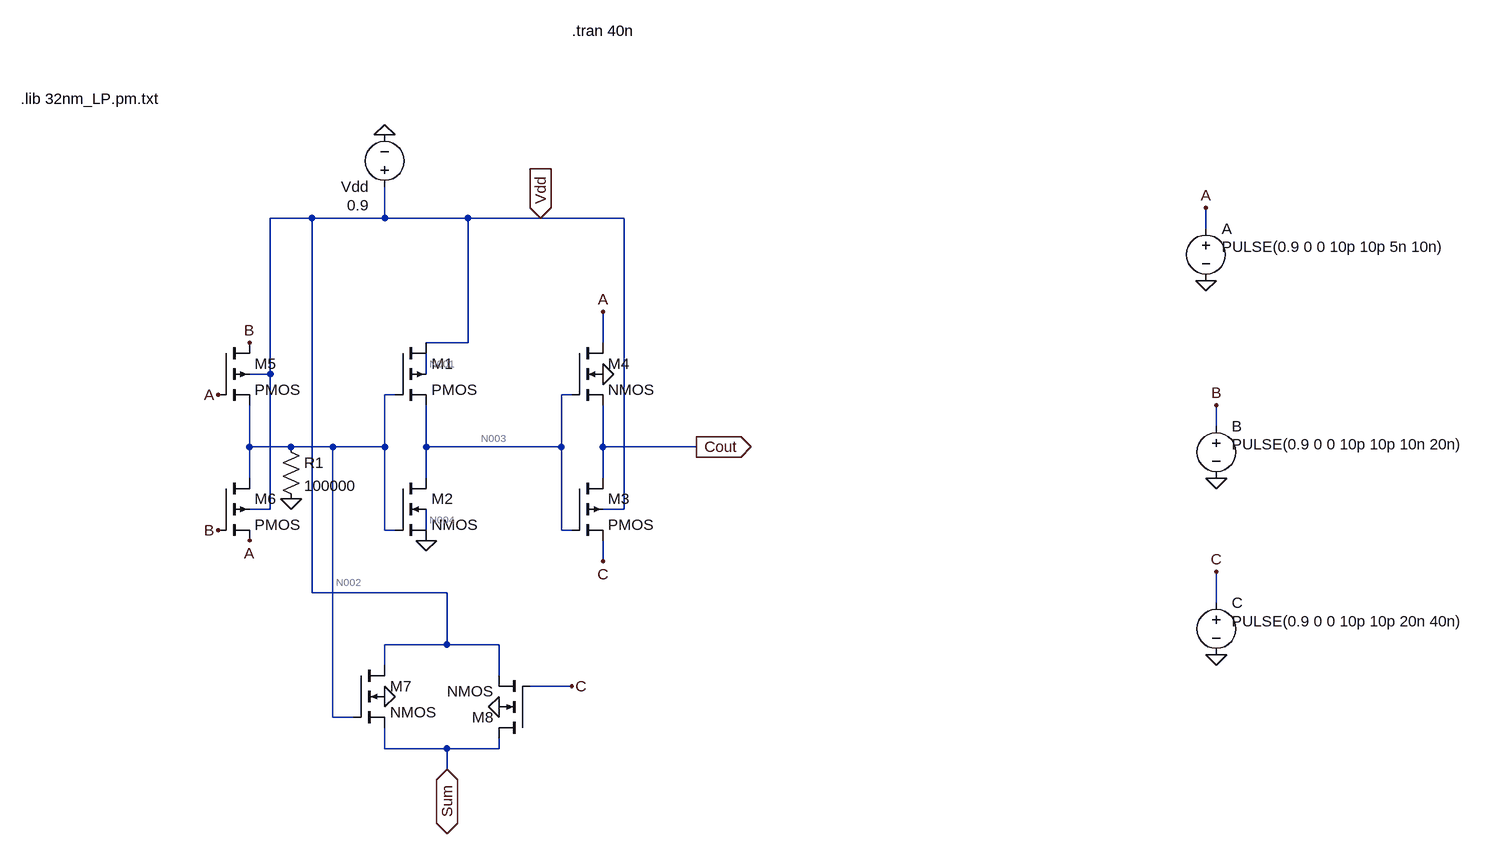
[diagram p0: schematic InXA2_32nm.asc]
InXA2_32nm.asc, the LTspice schematic file:
Version 4
SHEET 1 1044 720
WIRE -752 -240 -816 -240
WIRE -640 -240 -640 -288
WIRE -640 -240 -752 -240
WIRE -512 -240 -640 -240
WIRE -400 -240 -512 -240
WIRE -272 -240 -400 -240
WIRE 624 -224 624 -256
WIRE -512 -48 -512 -240
WIRE -512 -48 -576 -48
WIRE -304 -48 -304 -96
WIRE -816 0 -816 -240
WIRE -816 0 -848 0
WIRE -576 0 -576 -32
WIRE -624 32 -640 32
WIRE -352 32 -368 32
WIRE 640 80 640 48
WIRE -848 112 -848 48
WIRE -784 112 -848 112
WIRE -720 112 -784 112
WIRE -640 112 -640 32
WIRE -640 112 -720 112
WIRE -576 112 -576 48
WIRE -368 112 -368 32
WIRE -368 112 -576 112
WIRE -304 112 -304 48
WIRE -160 112 -304 112
WIRE -848 160 -848 112
WIRE -576 160 -576 112
WIRE -304 160 -304 112
WIRE -816 208 -816 0
WIRE -816 208 -848 208
WIRE -272 208 -272 -240
WIRE -272 208 -304 208
WIRE -640 240 -640 112
WIRE -624 240 -640 240
WIRE -576 240 -576 208
WIRE -368 240 -368 112
WIRE -352 240 -368 240
WIRE -304 288 -304 256
WIRE -752 336 -752 -240
WIRE -544 336 -752 336
WIRE 640 352 640 304
WIRE -544 416 -544 336
WIRE -544 416 -640 416
WIRE -464 416 -544 416
WIRE -640 448 -640 416
WIRE -464 464 -464 416
WIRE -352 480 -416 480
WIRE -720 528 -720 112
WIRE -688 528 -720 528
WIRE -640 576 -640 544
WIRE -544 576 -640 576
WIRE -464 576 -464 560
WIRE -464 576 -544 576
WIRE -544 608 -544 576
FLAG 624 -144 0
FLAG 640 160 0
FLAG 640 432 0
FLAG 624 -256 A
FLAG 640 48 B
FLAG 640 304 C
FLAG -400 -240 Vdd
IOPIN -400 -240 In
FLAG -640 -368 0
FLAG -896 32 A
FLAG -848 256 A
FLAG -896 240 B
FLAG -848 -48 B
FLAG -576 256 0
FLAG -304 0 0
FLAG -304 -96 A
FLAG -304 288 C
FLAG -160 112 Cout
IOPIN -160 112 Out
FLAG -544 608 Sum
IOPIN -544 608 BiDir
FLAG -352 480 C
FLAG -640 496 0
FLAG -464 512 0
FLAG -784 192 0
SYMBOL voltage 624 -240 R0
WINDOW 3 24 44 Left 2
WINDOW 123 0 0 Left 0
WINDOW 39 0 0 Left 0
SYMATTR Value PULSE(0.9 0 0 10p 10p 5n 10n)
SYMATTR InstName A
SYMBOL voltage 640 64 R0
WINDOW 3 24 44 Left 2
WINDOW 123 0 0 Left 0
WINDOW 39 0 0 Left 0
SYMATTR Value PULSE(0.9 0 0 10p 10p 10n 20n)
SYMATTR InstName B
SYMBOL voltage 640 336 R0
WINDOW 3 24 44 Left 2
WINDOW 123 0 0 Left 0
WINDOW 39 0 0 Left 0
SYMATTR Value PULSE(0.9 0 0 10p 10p 20n 40n)
SYMATTR InstName C
SYMBOL voltage -640 -272 R180
WINDOW 3 24 -12 Left 2
WINDOW 123 0 0 Left 0
WINDOW 39 0 0 Left 0
SYMATTR Value 0.9
SYMATTR InstName Vdd
SYMBOL pmos4 -624 -48 R0
SYMATTR InstName M1
SYMATTR Value2 l=32n w=128n
SYMBOL nmos4 -624 160 R0
SYMATTR InstName M2
SYMATTR Value2 l=32n w=64n
SYMBOL nmos4 -352 -48 R0
SYMATTR InstName M4
SYMATTR Value2 l=32n w=64n
SYMBOL pmos4 -352 160 R0
SYMATTR InstName M3
SYMATTR Value2 l=32n w=128n
SYMBOL pmos4 -896 -48 R0
SYMATTR InstName M5
SYMATTR Value2 l=32n w=128n
SYMBOL pmos4 -896 160 R0
SYMATTR InstName M6
SYMATTR Value2 l=32n w=128n
SYMBOL nmos4 -688 448 R0
SYMATTR InstName M7
SYMATTR Value2 l=32n w=64n
SYMBOL nmos4 -416 560 R180
SYMATTR InstName M8
SYMATTR Value2 l=32n w=64n
SYMBOL res -800 96 R0
SYMATTR InstName R1
SYMATTR Value 100000
TEXT -1200 -424 Left 2 !.lib 32nm_LP.pm.txt
TEXT -352 -528 Left 2 !.tran 40n

The netlist it stands for:
* InXA2_32nm.asc
V§A A 0 PULSE(0.9 0 0 10p 10p 5n 10n)
V§B B 0 PULSE(0.9 0 0 10p 10p 10n 20n)
V§C C 0 PULSE(0.9 0 0 10p 10p 20n 40n)
Vdd Vdd 0 0.9
M1 Vdd N002 N003 N001 PMOS l=32n w=128n
M2 N003 N002 0 N004 NMOS l=32n w=64n
M4 A N003 Cout 0 NMOS l=32n w=64n
M3 Cout N003 C Vdd PMOS l=32n w=128n
M5 B A N002 Vdd PMOS l=32n w=128n
M6 N002 B A Vdd PMOS l=32n w=128n
M7 Vdd N002 Sum 0 NMOS l=32n w=64n
M8 Sum C Vdd 0 NMOS l=32n w=64n
R1 N002 0 100000
.model NMOS NMOS
.model PMOS PMOS
.lib standard.mos
.lib 32nm_LP.pm.txt
.tran 40n
.backanno
.end

* Results of the author's LTspice run, read from the files saved beside the schematic
* Operating Point, zero values left out:
*   V(a) = 900 mV
*   V(b) = 900 mV
*   V(c) = 900 mV
*   V(vdd) = 900 mV
*   V(n002) = 486.9 µV
*   V(n003) = 899.9 mV
*   V(n001) = 765.9 mV
*   V(n004) = 256.2 mV
*   V(cout) = 895.7 mV
*   V(sum) = 780.8 mV
*   Id(M8) = -13.39 pA
*   Ib(M8) = -1.694 pA
*   Is(M8) = 15.07 pA
*   Id(M7) = 22.51 pA
*   Ig(M7) = -34.21 pA
*   Ib(M7) = -1.691 pA
*   Is(M7) = 13.39 pA
*   Ib(M4) = -1.809 pA
*   Id(M2) = 15.41 nA
*   Ig(M2) = -21.6 pA
*   Is(M2) = -15.39 nA
*   Id(M6) = -2.406 nA
*   Is(M6) = 2.405 nA
*   Id(M5) = 2.405 nA
*   Is(M5) = -2.406 nA
*   Id(M1) = 15.41 nA
*   Ig(M1) = -1.286 pA
*   Is(M1) = -15.41 nA
*   I(R1) = 4.869 nA
*   I(Vdd) = -15.45 nA
*   I(B) = -2.405 nA
*   I(A) = -2.406 nA
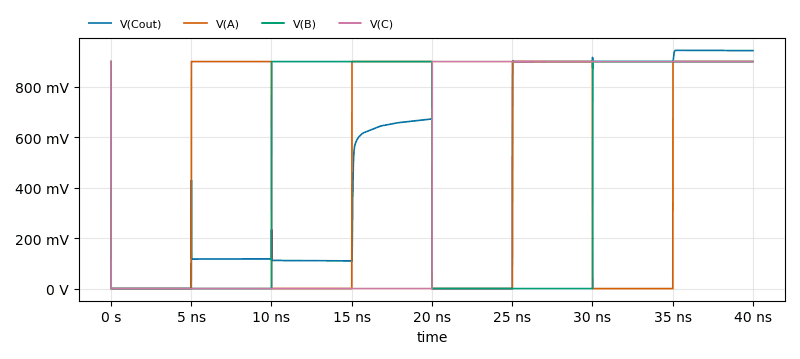
[diagram p1: Transient Analysis of InXA2_32nm.asc, plotted from the saved traces]
* Transient Analysis, 1 run:
*   V(Cout): min -908.3 µV, max 944.4 mV, average 450.9 mV, rms 606.6 mV, last 943.5 mV
*   V(A): min 0 V, max 900 mV, average 449.1 mV, rms 635.6 mV, last 900 mV
*   V(B): min 0 V, max 900 mV, average 449.5 mV, rms 636 mV, last 900 mV
*   V(C): min 0 V, max 900 mV, average 449.8 mV, rms 636.2 mV, last 900 mV